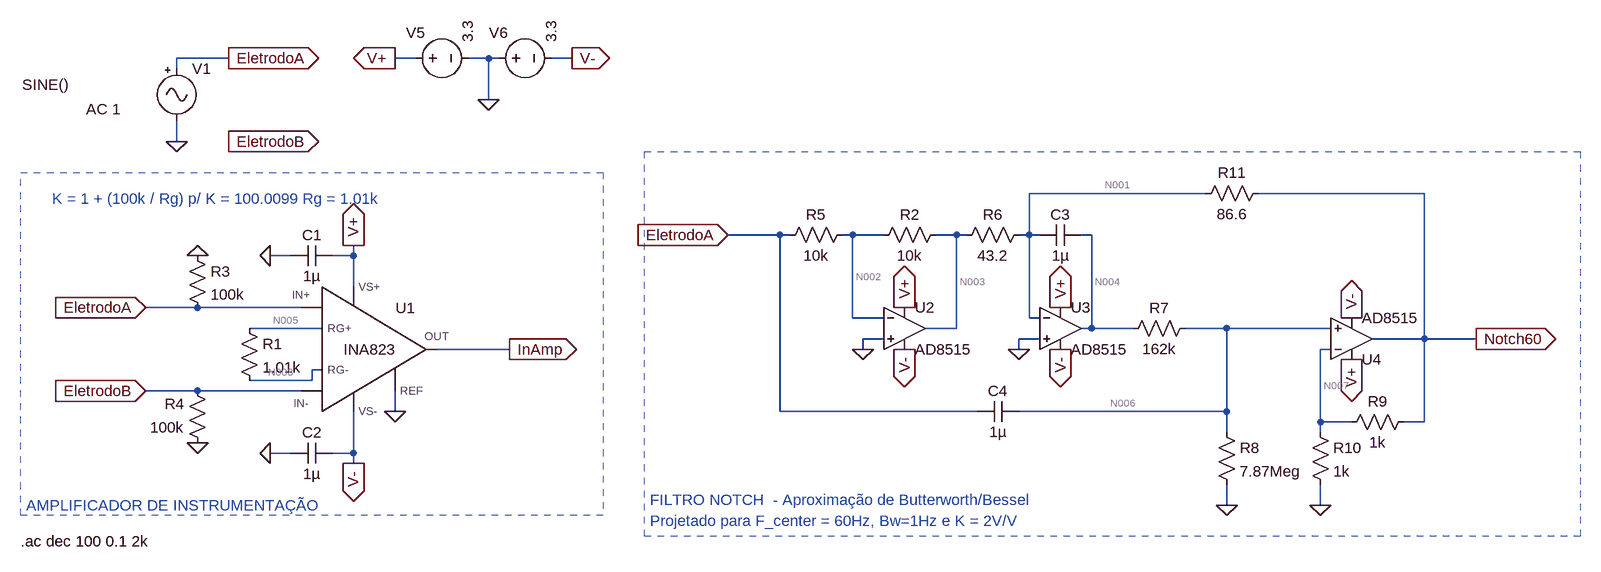
[diagram p0: schematic cana_tl.asc]
cana_tl.asc, the LTspice schematic file:
Version 4
SHEET 1 4468 1732
WIRE -576 -320 -656 -320
WIRE -288 -320 -320 -320
WIRE -176 -320 -208 -320
WIRE -160 -320 -176 -320
WIRE -48 -320 -80 -320
WIRE -656 -304 -656 -320
WIRE -176 -256 -176 -320
WIRE -656 -192 -656 -224
WIRE 928 -112 656 -112
WIRE 1264 -112 1008 -112
WIRE 272 -48 192 -48
WIRE 288 -48 272 -48
WIRE 384 -48 368 -48
WIRE 432 -48 384 -48
WIRE 544 -48 512 -48
WIRE 560 -48 544 -48
WIRE 656 -48 656 -112
WIRE 656 -48 640 -48
WIRE 672 -48 656 -48
WIRE 752 -48 736 -48
WIRE -480 -16 -512 -16
WIRE -384 -16 -384 -32
WIRE -384 -16 -416 -16
WIRE -384 32 -384 -16
WIRE -624 64 -704 64
WIRE -464 64 -624 64
WIRE 384 80 384 -48
WIRE 432 80 384 80
WIRE 656 80 656 -48
WIRE 672 80 656 80
WIRE -432 96 -544 96
WIRE 544 96 544 -48
WIRE 544 96 496 96
WIRE 752 96 752 -48
WIRE 752 96 736 96
WIRE 816 96 752 96
WIRE 960 96 896 96
WIRE 1120 96 960 96
WIRE 432 112 400 112
WIRE 672 112 640 112
WIRE 1264 112 1264 -112
WIRE 1264 112 1184 112
WIRE 1344 112 1264 112
WIRE -144 128 -256 128
WIRE 400 128 400 112
WIRE 640 128 640 112
WIRE 1120 128 1104 128
WIRE -432 160 -448 160
WIRE -448 176 -448 160
WIRE -448 176 -544 176
WIRE -624 192 -704 192
WIRE -464 192 -624 192
WIRE -320 224 -320 192
WIRE 272 224 272 -48
WIRE 576 224 272 224
WIRE 960 224 960 96
WIRE 960 224 640 224
WIRE 1104 240 1104 128
WIRE 1152 240 1104 240
WIRE 1264 240 1264 112
WIRE 1264 240 1232 240
WIRE 960 256 960 224
WIRE 1104 256 1104 240
WIRE -480 288 -512 288
WIRE -384 288 -384 224
WIRE -384 288 -416 288
WIRE -384 304 -384 288
WIRE 960 368 960 336
WIRE 1104 368 1104 336
FLAG -624 -16 0
FLAG -624 272 0
FLAG -576 -320 EletrodoA
IOPIN -576 -320 Out
FLAG -576 -192 EletrodoB
IOPIN -576 -192 Out
FLAG -704 64 EletrodoA
IOPIN -704 64 In
FLAG -704 192 EletrodoB
IOPIN -704 192 In
FLAG -144 128 InAmp
IOPIN -144 128 Out
FLAG -176 -256 0
FLAG -320 -320 V+
IOPIN -320 -320 Out
FLAG -48 -320 V-
IOPIN -48 -320 Out
FLAG -384 304 V-
IOPIN -384 304 Out
FLAG -384 -32 V+
IOPIN -384 -32 Out
FLAG -320 224 0
FLAG -512 -16 0
FLAG -512 288 0
FLAG 400 128 0
FLAG 464 64 V+
IOPIN 464 64 Out
FLAG 464 128 V-
IOPIN 464 128 Out
FLAG 704 64 V+
IOPIN 704 64 Out
FLAG 704 128 V-
IOPIN 704 128 Out
FLAG 640 128 0
FLAG 960 368 0
FLAG 1152 144 V+
IOPIN 1152 144 Out
FLAG 1152 80 V-
IOPIN 1152 80 Out
FLAG 1104 368 0
FLAG 192 -48 EletrodoA
IOPIN 192 -48 In
FLAG 1344 112 Notch60
IOPIN 1344 112 Out
FLAG -656 -192 0
SYMBOL INA823 -368 128 R0
SYMATTR InstName U1
SYMBOL res -640 -32 R0
SYMATTR InstName R3
SYMATTR Value 100k
SYMBOL res -608 288 R180
WINDOW 0 36 76 Left 2
WINDOW 3 36 40 Left 2
SYMATTR InstName R4
SYMATTR Value 100k
SYMBOL voltage -304 -320 R270
WINDOW 123 0 0 Left 0
WINDOW 39 0 0 Left 0
WINDOW 0 39 1 VRight 2
SYMATTR InstName V5
SYMATTR Value 3.3
SYMBOL voltage -176 -320 R270
WINDOW 123 0 0 Left 0
WINDOW 39 0 0 Left 0
WINDOW 0 39 1 VRight 2
SYMATTR InstName V6
SYMATTR Value 3.3
SYMBOL cap -416 -32 R90
WINDOW 0 0 32 VBottom 2
WINDOW 3 32 32 VTop 2
SYMATTR InstName C1
SYMATTR Value 1µ
SYMBOL cap -416 272 R90
WINDOW 0 0 32 VBottom 2
WINDOW 3 32 32 VTop 2
SYMATTR InstName C2
SYMATTR Value 1µ
SYMBOL res -560 80 R0
SYMATTR InstName R1
SYMATTR Value 1.01k
SYMBOL Misc\\signal -656 -320 R0
WINDOW 3 -238 41 Left 2
WINDOW 123 -139 78 Left 2
WINDOW 39 0 0 Left 0
SYMATTR Value SINE()
SYMATTR Value2 AC 1
SYMATTR InstName V1
SYMBOL res 528 -64 R90
WINDOW 0 0 56 VBottom 2
WINDOW 3 32 56 VTop 2
SYMATTR InstName R2
SYMATTR Value 10k
SYMBOL res 384 -64 R90
WINDOW 0 0 56 VBottom 2
WINDOW 3 32 56 VTop 2
SYMATTR InstName R5
SYMATTR Value 10k
SYMBOL res 656 -64 R90
WINDOW 0 0 56 VBottom 2
WINDOW 3 32 56 VTop 2
SYMATTR InstName R6
SYMATTR Value 43.2
SYMBOL cap 736 -64 R90
WINDOW 0 0 32 VBottom 2
WINDOW 3 32 32 VTop 2
SYMATTR InstName C3
SYMATTR Value 1µ
SYMBOL res 912 80 R90
WINDOW 0 0 56 VBottom 2
WINDOW 3 32 56 VTop 2
SYMATTR InstName R7
SYMATTR Value 162k
SYMBOL cap 640 208 R90
WINDOW 0 0 32 VBottom 2
WINDOW 3 32 32 VTop 2
SYMATTR InstName C4
SYMATTR Value 1µ
SYMBOL res 944 240 R0
SYMATTR InstName R8
SYMATTR Value 7.87Meg
SYMBOL res 1248 224 R90
WINDOW 0 0 56 VBottom 2
WINDOW 3 32 56 VTop 2
SYMATTR InstName R9
SYMATTR Value 1k
SYMBOL res 1088 240 R0
SYMATTR InstName R10
SYMATTR Value 1k
SYMBOL res 1024 -128 R90
WINDOW 0 0 56 VBottom 2
WINDOW 3 32 56 VTop 2
SYMATTR InstName R11
SYMATTR Value 86.6
SYMBOL OpAmps\\AD8515 464 32 R0
SYMATTR InstName U2
SYMBOL OpAmps\\AD8515 704 32 R0
SYMATTR InstName U3
SYMBOL OpAmps\\AD8515 1152 176 M180
SYMATTR InstName U4
TEXT -848 -104 Left 2 ;K = 1 + (100k / Rg) p/ K = 100.0099 Rg = 1.01k
TEXT -888 368 Left 2 ;AMPLIFICADOR DE INSTRUMENTAÇÃO
TEXT 72 360 Left 2 ;FILTRO NOTCH  - Aproximação de Butterworth/Bessel
TEXT 72 392 Left 2 ;Projetado para F_center = 60Hz, Bw=1Hz e K = 2V/V
TEXT -896 424 Left 2 !.ac dec 100 0.1 2k
RECTANGLE Normal 0 384 -896 -144 2
RECTANGLE Normal 1504 416 64 -176 2

The netlist it stands for:
* cana_tl.asc
XU1 EletrodoA EletrodoB V+ V- InAmp 0 N005 N008 INA823  ; pins IN+ IN- VS+ VS- OUT REF RG+ RG-
R3 0 EletrodoA 100k
R4 0 EletrodoB 100k
V5 V+ 0 3.3
V6 0 V- 3.3
C1 V+ 0 1µ
C2 V- 0 1µ
R1 N005 N008 1.01k
V1 EletrodoA 0 SINE() AC 1
R2 N003 N002 10k
R5 N002 EletrodoA 10k
R6 N001 N003 43.2
C3 N004 N001 1µ
R7 N006 N004 162k
C4 N006 EletrodoA 1µ
R8 N006 0 7.87Meg
R9 Notch60 N007 1k
R10 N007 0 1k
R11 Notch60 N001 86.6
XU2 0 N002 V+ V- N003 AD8515  ; pins In+ In- V+ V- OUT
XU3 0 N001 V+ V- N004 AD8515  ; pins In+ In- V+ V- OUT
XU4 N006 N007 V+ V- Notch60 AD8515  ; pins In+ In- V+ V- OUT
* K = 1 + (100k / Rg) p/ K = 100.0099 Rg = 1.01k
* AMPLIFICADOR DE INSTRUMENTAÇÃO
* FILTRO NOTCH  - Aproximação de Butterworth/Bessel
* Projetado para F_center = 60Hz, Bw=1Hz e K = 2V/V
.ac dec 100 0.1 2k
.lib Z:\mnt\9a3f66c9-6d6d-4e50-b992-ca8f034e1022\Download\EEG\canal\INA823.LIB
.lib ADI.lib
.backanno
.end

* Results of the author's LTspice run, read from the files saved beside the schematic
* Operating Point, zero values left out:
*   V(n008) = 645 mV
*   V(n005) = 645.2 mV
*   V(v+) = 3.3 V
*   V(v-) = -3.3 V
*   V(inamp) = 18.15 mV
*   V(eletrodob) = -160 µV
*   V(n003) = 2 mV
*   V(n002) = 1 mV
*   V(n001) = 1 mV
*   V(n004) = -1.533 mV
*   V(n006) = -1.502 mV
*   V(notch60) = -1.005 mV
*   V(n007) = -502.3 µV
*   I(R11) = -23.15 µA
*   I(R10) = -502.3 nA
*   I(R9) = -502.3 nA
*   I(R8) = -190.9 pA
*   I(R7) = 189.8 pA
*   I(R6) = -23.15 µA
*   I(R5) = 100 nA
*   I(R2) = 100 nA
*   I(R1) = 178.1 nA
*   I(R4) = 1.6 nA
*   I(V1) = 97.6 nA
*   I(V6) = -1.246 mA
*   I(V5) = -1.253 mA
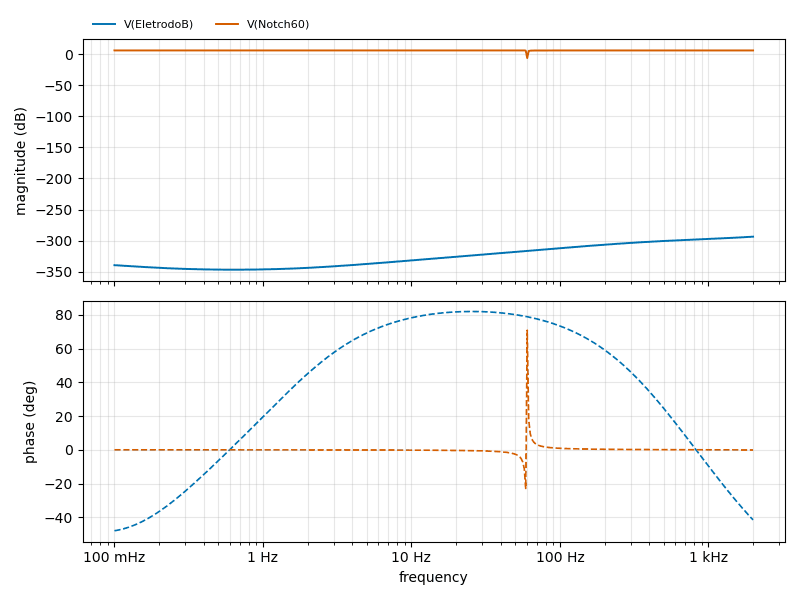
[diagram p1: AC Analysis of cana_tl.asc, plotted from the saved traces]
* AC Analysis, 1 run:
*   V(EletrodoB): -339.61 dB at 100 mHz, -293.74 dB at 2 kHz, peak -293.74 dB at 2 kHz, 3 dB below the peak at 1.159 kHz
*   V(Notch60): 6.04 dB at 100 mHz, 6.02 dB at 2 kHz, peak 6.10 dB at 56.23 Hz, 3 dB below the peak at 59.19 Hz